# EAGLE schematic greenhousectrl-latest-compressed (EAGLE 7.7.0)
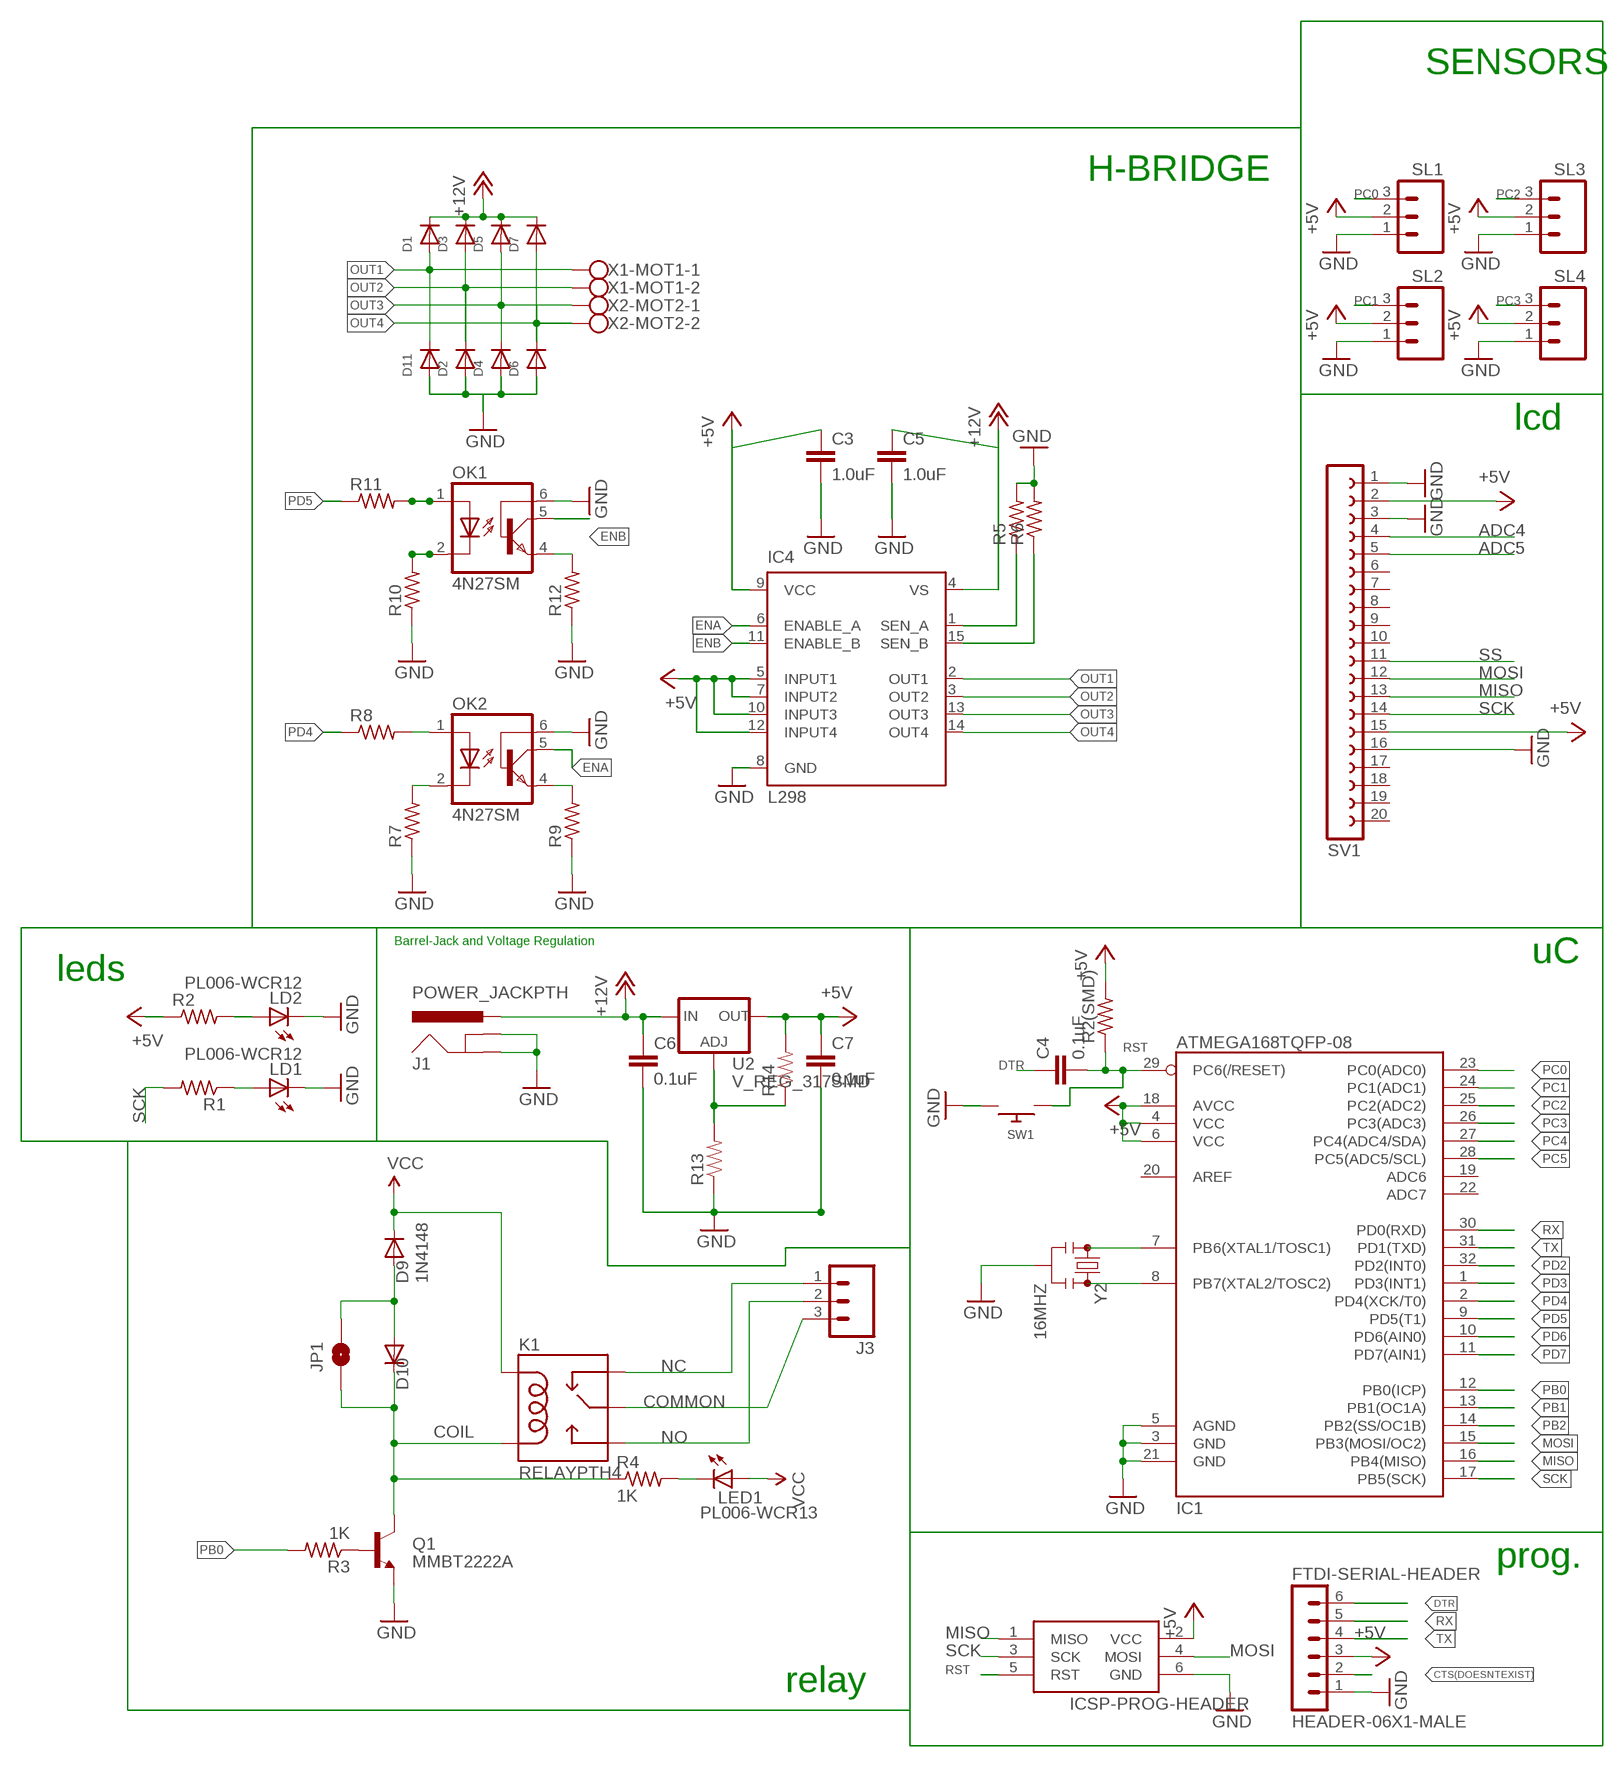
[diagram p0: schematic, sheet 1]

## Parts
C3  1.0uF  1.0UF-25V-+80/-20(0805)"  [0805-CAP]
C4  0.1uF  0.1UF-25V(+80/-20%)(0603)  [0603-CAP]
C5  1.0uF  1.0UF-25V-+80/-20(0805)"  [0805-CAP]
C6  0.1uF  0.1UF-25V(+80/-20%)(0603)  [0603-CAP]
C7  0.1uF  0.1UF-25V(+80/-20%)(0603)  [0603-CAP]
D1  DIODESOD-523  [SOD-523]
D2  DIODESOD-523  [SOD-523]
D3  DIODESOD-523  [SOD-523]
D4  DIODESOD-523  [SOD-523]
D5  DIODESOD-523  [SOD-523]
D6  DIODESOD-523  [SOD-523]
D7  DIODESOD-523  [SOD-523]
D9  1N4148  DIODESOD-323F  [SOD-323F]
D10  Zener  DIODESOD-323F  [SOD-323F]
D11  DIODESOD-523  [SOD-523]
FTDI-SERIAL-HEADER  HEADER-06X1-MALE  [06X1-PTH]
IC1  ATMEGA168TQFP-08  [TQFP32-08]
IC4  L298  [MULTIWATT-15]
ICSP-PROG-HEADER  AVRISP-6  [AVRISP]
J1  POWER_JACKPTH  [POWER_JACK_PTH]
J3  M03-SCREW-5MM  [SCREWTERMINAL-5MM-3]
JP1  JUMPER-PAD-2-NOYES_SILK  [PAD-JUMPER-2-NO_YES_SILK]
K1  RELAYPTH4  [RELAY-JZC]
LD1  PL006-WCR12  [SOT23]
LD2  PL006-WCR12  [SOT23]
LED1  PL006-WCR13  [SOT23]
OK1  4N27SM  [DIL6-SMD]
OK2  4N27SM  [DIL6-SMD]
Q1  MMBT2222A  TRANSISTOR_NPNMMBT2222A  [SOT23-3]
R1  R-US_M0805  [M0805]
R2  R-US_M0805  [M0805]
R2(SMD)  R-US_M0805  [M0805]
R3  1K  R-US_M0805  [M0805]
R4  1K  R-US_M0805  [M0805]
R5  R-US_M0805  [M0805]
R6  R-US_M0805  [M0805]
R7  R-US_M0805  [M0805]
R8  R-US_M0805  [M0805]
R9  R-US_M0805  [M0805]
R10  R-US_M0805  [M0805]
R11  R-US_M0805  [M0805]
R12  R-US_M0805  [M0805]
R13  RESISTOR0402  [0402-RES]
R14  RESISTOR0402  [0402-RES]
SL1  M03  [03P]
SL2  M03  [03P]
SL3  M03  [03P]
SL4  M03  [03P]
SV1  FE20-1  [FE20]
SW1  SWITCH_PUSHBUTTONC&K_KSS  [BTN_CK_KSS]
U2  V_REG_317SMD  [SOT223]
X1-MOT1  W237-102  [W237-102]
X2-MOT2  W237-102  [W237-102]
Y2  16MHZ  RESONATOR16MHZ  [RESONATOR-SMD]

## Nets
+5V: C3.1 C7.1 FTDI-SERIAL-HEADER.3 IC1.4(VCC) IC1.6(VCC) IC1.18(AVCC) IC4.5(INPUT1) IC4.7(INPUT2) IC4.9(VCC) IC4.10(INPUT3) IC4.12(INPUT4) ICSP-PROG-HEADER.2(VCC) R2(SMD).2 R2.1 R14.2 SL1.2 SL2.2 SL3.2 SL4.2 SV1.2 SV1.15 U2.2(OUT)
+12V: C5.1 C6.1 D1.K(C) D3.K(C) D5.K(C) D7.K(C) IC4.4(VS) J1.PWR U2.3(IN)
ADC4: SV1.4
ADC5: SV1.5
COIL: D10.C JP1.1 K1.1(COIL2) Q1.3(C) R4.1
COMMON: J3.3 K1.4(MAIN)
CTS(DOESNTEXIST): FTDI-SERIAL-HEADER.2
DIODENODE: D9.A D10.A JP1.2
DTR: C4.1 FTDI-SERIAL-HEADER.6
ENA: IC4.6(ENABLE_A) OK2.5(COL)
ENB: IC4.11(ENABLE_B) OK1.5(COL)
GND: C3.2 C5.2 C6.2 C7.2 D2.A D4.A D6.A D11.A FTDI-SERIAL-HEADER.1 IC1.3(GND) IC1.5(AGND) IC1.21(GND) IC4.8(GND) ICSP-PROG-HEADER.6(GND) J1.GND J1.GNDBREAK LD1.3(C) LD2.3(C) OK1.6(BAS) OK2.6(BAS) Q1.2(E) R5.2 R6.2 R7.1 R9.1 R10.1 R12.1 R13.1 SL1.1 SL2.1 SL3.1 SL4.1 SV1.1 SV1.3 SV1.16 SW1.P$2 Y2.2
MISO: IC1.16(PB4(MISO)) ICSP-PROG-HEADER.1(MISO) SV1.13
MOSI: IC1.15(PB3(MOSI/OC2)) ICSP-PROG-HEADER.4(MOSI) SV1.12
N$1: OK2.1(A) R8.2
N$2: LD2.1(A) R2.2
N$3: LED1.3(C) R4.2
N$4: OK2.2(C) R7.2
N$5: OK2.4(EMI) R9.2
N$6: Q1.1(B) R3.1
N$7: R13.2 R14.1 U2.1(ADJ)
N$8: OK1.1(A) R11.2
N$9: OK1.2(C) R10.2
N$10: LD1.1(A) R1.1
N$11: IC1.7(PB6(XTAL1/TOSC1)) Y2.1
N$15: OK1.4(EMI) R12.2
N$16: IC1.8(PB7(XTAL2/TOSC2)) Y2.3
NC: J3.1 K1.2(NC)
NO: J3.2 K1.3(NO)
OUT1: D1.A D11.K(C) IC4.2(OUT1) X1-MOT1.1
OUT2: D2.K(C) D3.A IC4.3(OUT2) X1-MOT1.2
OUT3: D4.K(C) D5.A IC4.13(OUT3) X2-MOT2.1
OUT4: D6.K(C) D7.A IC4.14(OUT4) X2-MOT2.2
PB0: IC1.12(PB0(ICP)) R3.2
PB1: IC1.13(PB1(OC1A))
PB2: IC1.14(PB2(SS/OC1B))
PC0: IC1.23(PC0(ADC0)) SL1.3
PC1: IC1.24(PC1(ADC1)) SL2.3
PC2: IC1.25(PC2(ADC2)) SL3.3
PC3: IC1.26(PC3(ADC3)) SL4.3
PC4: IC1.27(PC4(ADC4/SDA))
PC5: IC1.28(PC5(ADC5/SCL))
PD2: IC1.32(PD2(INT0))
PD3: IC1.1(PD3(INT1))
PD4: IC1.2(PD4(XCK/T0)) R8.1
PD5: IC1.9(PD5(T1)) R11.1
PD6: IC1.10(PD6(AIN0))
PD7: IC1.11(PD7(AIN1))
RST: C4.2 IC1.29(PC6(/RESET)) ICSP-PROG-HEADER.5(RST) R2(SMD).1 SW1.P$1
RX: FTDI-SERIAL-HEADER.5 IC1.30(PD0(RXD))
SCK: IC1.17(PB5(SCK)) ICSP-PROG-HEADER.3(SCK) R1.2 SV1.14
SEN_A: IC4.1(SEN_A) R5.1
SEN_B: IC4.15(SEN_B) R6.1
SS: SV1.11
TX: FTDI-SERIAL-HEADER.4 IC1.31(PD1(TXD))
VCC: D9.C K1.5(COIL1) LED1.1(A)
Unconnected: IC1.19(ADC6) IC1.20(AREF) IC1.22(ADC7) SV1.6 SV1.7 SV1.8 SV1.9 SV1.10 SV1.17 SV1.18 SV1.19 SV1.20

## Notes on the sheet
- SENSORS
- H-BRIDGE
- lcd
- Barrel-Jack and Voltage Regulation
- uC
- leds
- prog.
- relay

## Library data of the parts
C3 C5 = SparkFun-Capacitors:1.0UF-25V-+80/-20(0805): CAP-11625; PROD_ID: CAP-11625
C4 C6 C7 = SparkFun-Capacitors:0.1UF-25V(+80/-20%)(0603): CAP-00810 Ceramic Standard decoupling cap; PROD_ID: CAP-00810
D1-D7 D10 D11 = adafruit:DIODE: Diode SMADIODE - SMA Surface Mount Package 20V 1A Schottky Diode Digikey: 641-1014-6-ND DO-1N4148 - Through Hole Small Current Diode SOD-123 20V 1 A (.5mV Vf) Schottky Diode - Digikey: MBRX120TPMSCT-ND SOD-323 10V 570mA (.38mV Vf, 3ns) Schottky Diode - Digikey: ZLLS410CT-ND SOD-523 30V 30mA Schottky Diode (RB751S-40TE61) - Digikey: RB751S-40TE61CT-ND SOT23-R/W - SOT23 Package (R = Solder Paste/Reflow Ovens, W = Hand-Soldering) BAT54Film 40V 300mA - Digikey: 497-7162-1-ND
D9 = adafruit:DIODE: Diode SMADIODE - SMA Surface Mount Package 20V 1A Schottky Diode Digikey: 641-1014-6-ND DO-1N4148 - Through Hole Small Current Diode SOD-123 20V 1 A (.5mV Vf) Schottky Diode - Digikey: MBRX120TPMSCT-ND SOD-323 10V 570mA (.38mV Vf, 3ns) Schottky Diode - Digikey: ZLLS410CT-ND SOD-523 30V 30mA Schottky Diode (RB751S-40TE61) - Digikey: RB751S-40TE61CT-ND SOT23-R/W - SOT23 Package (R = Solder Paste/Reflow Ovens, W = Hand-Soldering) BAT54Film 40V 300mA - Digikey: 497-7162-1-ND; PROD_ID: DIO-08378
FTDI-SERIAL-HEADER = GeekAmmo:HEADER-06X1?: 6 x 0.1 inch Header 40x1 0.1inch Male Breakaway header can be used. - 4UCON 00834 <http://www.4uconnector.com/online/SearchPro.asp?FormName=ProSearch&FormAction=search&s_GroupNo=&s_keyword=00834> For female part, if possible use 6 x 1 without breaking.; OTHER: 4UCON 00834; URL: http://www.4uconnector.com/online/SearchPro.asp?FormName=ProSearch&FormAction=search&s_GroupNo=&s_keyword=00834
IC1 = atmega328p:ATMEGA168
IC4 = st-microelectronics:L298: DUAL FULL-BRIDGE DRIVER; MPN: L298N; OC_FARNELL: 1589425; OC_NEWARK: 32M1527
ICSP-PROG-HEADER = adafruit:AVRISP: AVR ISP HEADER Standard 6 pin header for AVR programming
J1 = SparkFun-Connectors:POWER_JACK: Power Jack This is the standard 5.5mm barrel jack for power. The PTH is the most common, proven, reliable, footprint. The Slot footprint only works if the mill layer is transmitted to the PCB fab house so be warned. Mating wall wart : TOL-00298 (and others); PROD_ID: CONN-08197
J3 = SparkFun-Connectors:M03: Header 3 Standard 3-pin 0.1" header. Use with straight break away headers (SKU : PRT-00116), right angle break away headers (PRT-00553), swiss pins (PRT-00743), machine pins (PRT-00117), and female headers (PRT-00115). Molex polarized connector foot print use with SKU : PRT-08232 with associated crimp pins and housings.; PROD_ID: CONN-10134; STOREFRONT_ID: PRT-08433
JP1 = SparkFun-Passives:JUMPER-PAD-2-NO
K1 = SparkFun-Electromechanical:RELAY: SPDT relay (COM-00101)
LD1 LD2 = led:PL006*: PLH006 Series SMD LED SOT23 PLH006-WCR21 Super Red PLH006-WCR12 High Eff Red PLH006-WCG13 Green PLH006-WCY01 Yellow www.p-tec.net Source: http://www.wittig-electronic.de/PTEC/PL006Series.pdf
LED1 = led:PL006*: PLH006 Series SMD LED SOT23 PLH006-WCR21 Super Red PLH006-WCR12 High Eff Red PLH006-WCG13 Green PLH006-WCY01 Yellow www.p-tec.net Source: http://www.wittig-electronic.de/PTEC/PL006Series.pdf; PROD_ID: DIO-09529
OK1 OK2 = optocoupler:4N*?M: General Purpose 6-Pin Phototransistor Optocouplers Source: http://www.fairchildsemi.com/ds/4N/4N35-M.pdf; MF: FAIRCHILD SEMICONDUCTOR; MPN: 4N27S-M; OC_FARNELL: unknown; OC_NEWARK: 05C3300
Q1 = SparkFun-DiscreteSemi:TRANSISTOR_NPN: Generic NPN BJT MMBT2222A - TRANS-08049 (SOT-23, 1A 40V) MPSA42 - TRANS-09116 (SOT-23, 500mA 300V) MMBT5088LT1G - TRANS-11160 (SOT-23, 50 mA 30V) BC547 - COM-08928 <http://www.sparkfun.com/products/8928> (TO-92 45V 100mA) (1.Collector 2.Base 3.Emitter) 2N3904 - COM-00521 <http://www.sparkfun.com/products/521> (TO-92 40V 200mA) (1.Emitter 2.Base 3.Collector) P2N2222A - COM-12852 <http://www.sparkfun.com/products/12852> (TO-92 40V 600mA) (1.Collector 2.Base 3.Emitter); PROD_ID: TRANS-08049
R1 R2 R2(SMD) R3-R12 = adafruit:R-US_: RESISTOR, American symbol
R13 R14 = SparkFun-Resistors:RESISTOR: Resistor Basic schematic elements and footprints for 0603, 1206, and PTH resistors.
SL1-SL4 = con-amp-quick:M03: AMP QUICK CONNECTOR; OC_FARNELL: unknown; OC_NEWARK: unknown
SV1 = con-lsta:FE20-1: FEMALE HEADER; OC_FARNELL: unknown; OC_NEWARK: unknown
SW1 = adafruit:SWITCH_PUSHBUTTON: Buttons SOFTTOUCHSMD_SJ - Soft touch temporary push button (Super Junk Akihabara) Compatible with SKPMANE010 [Mouser: 688-SKPMAN] C&K_KSS = Digikey: KSS221GLFS
U2 = SparkFun-PowerIC:V_REG_317: Voltage Regulator Standard LM317 adjustable voltage regulator. AOI (Adjust Output Input). Google 'LM317 Calculator' for easy to use app to get the two resistor values needed. 240/720 for 5V output. 240/390 for 3.3V output. Spark Fun Electronics SKU : COM-00527
X1-MOT1 X2-MOT2 = con-wago-500:W237-102: WAGO SCREW CLAMP; MPN: 237-102; OC_FARNELL: unknown; OC_NEWARK: 70K9898
Y2 = SparkFun-FreqCtrl:RESONATOR: Resonator Small SMD resonator. Used, eg, on the Arduino Pro/ Pro Mini boards. 8MHz- XTAL-08895 16MHz- XTAL-08900; PROD_ID: XTAL-08900